# EAGLE design source_eagle (EAGLE 9.6.2)
COMPANY: ADAFRUIT INDUSTRIES; DRAWN: KTOWN; REV: A; YEAR: 2019
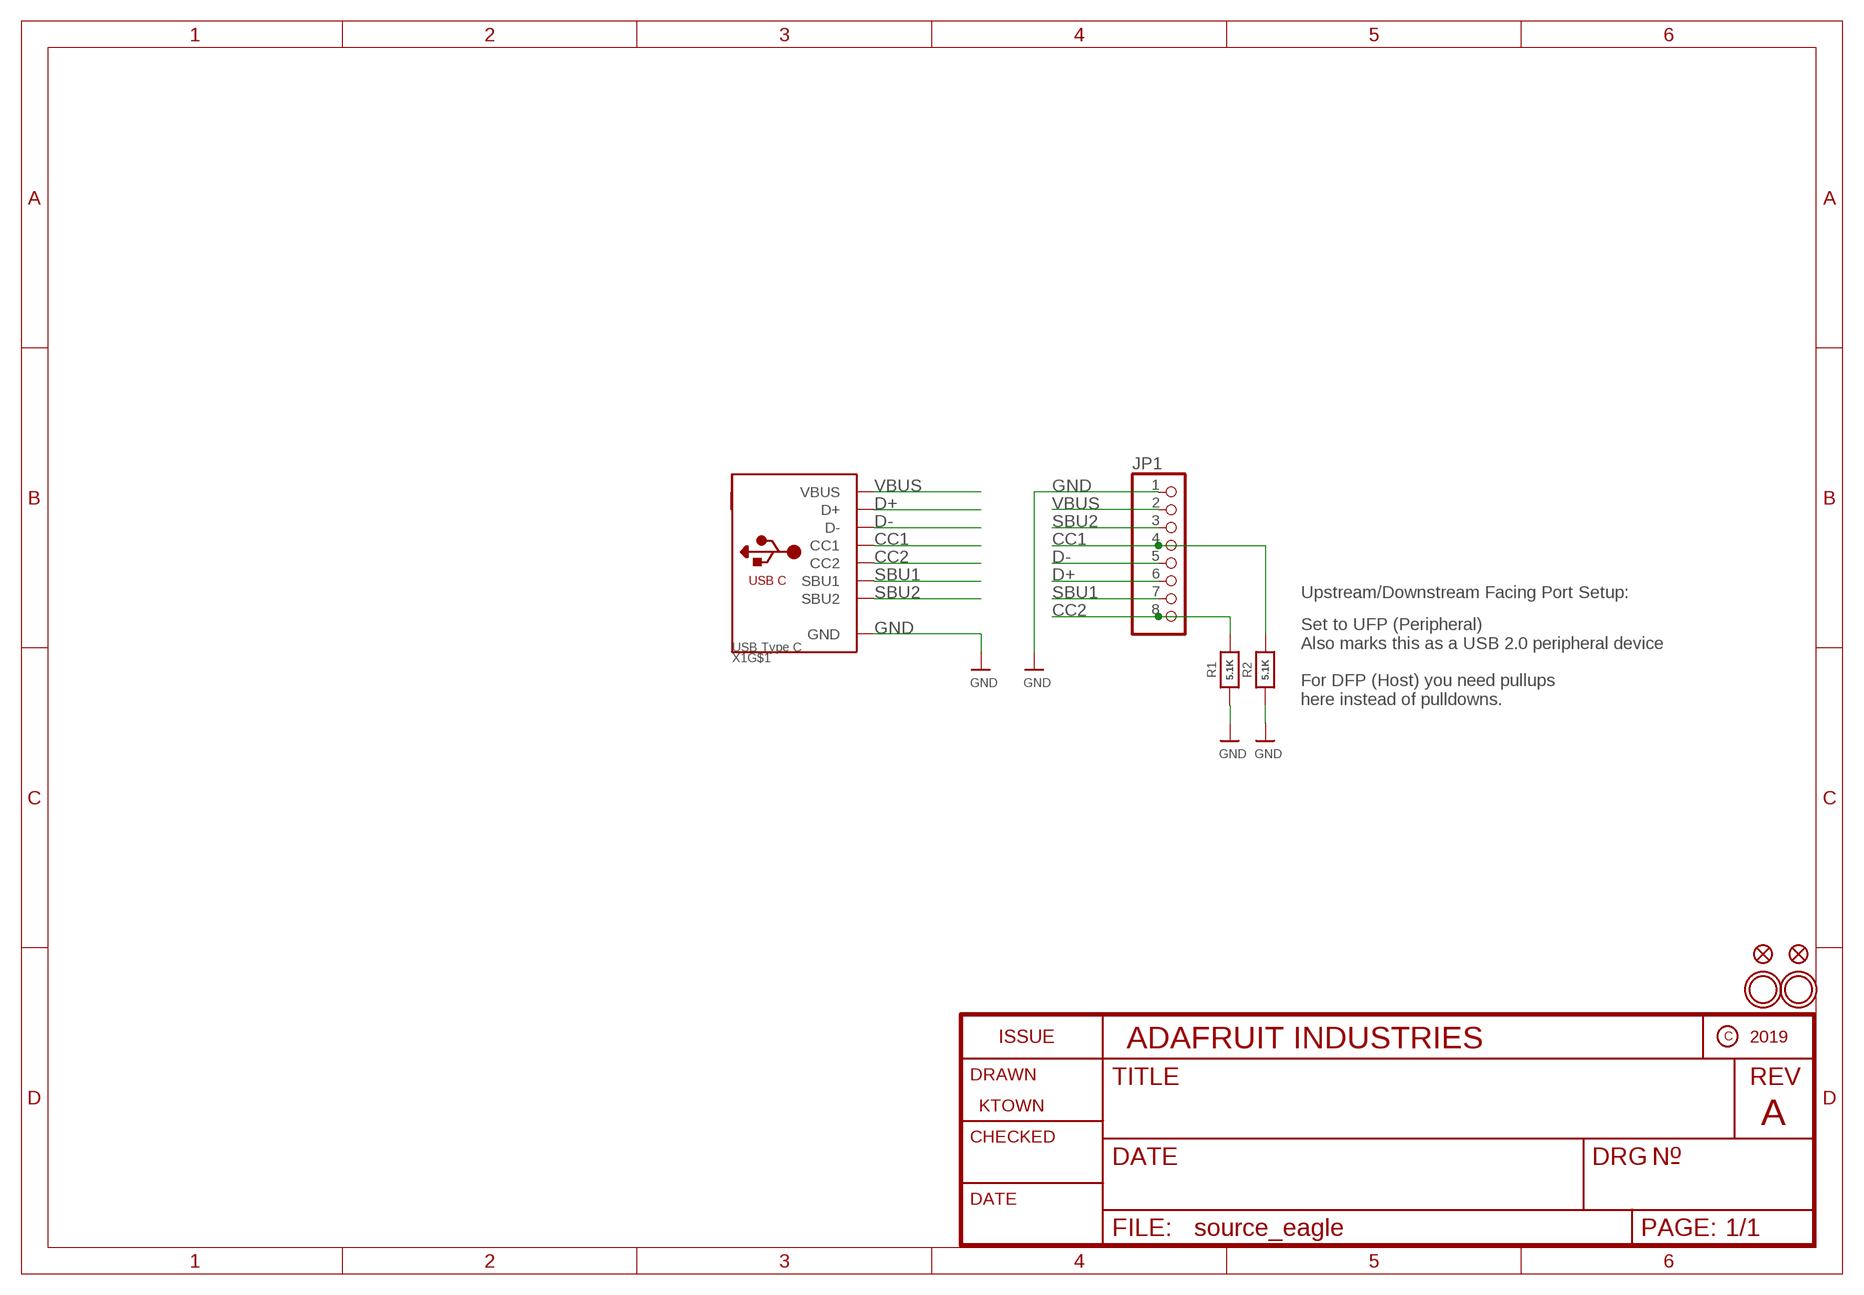
[diagram p0: schematic, sheet 1]

## Parts
FID1  FIDUCIAL_0.5MM  [FIDUCIAL_0.5MM]
FID2  FIDUCIAL_0.5MM  [FIDUCIAL_0.5MM]
JP1  HEADER-1X876MIL  [1X08_ROUND_76]
R1  5.1K  RESISTOR_0603_NOOUT  [0603-NO]
R2  5.1K  RESISTOR_0603_NOOUT  [0603-NO]
U$1  MOUNTINGHOLE2.5  [MOUNTINGHOLE_2.5_PLATED]
U$2  MOUNTINGHOLE2.5  [MOUNTINGHOLE_2.5_PLATED]
X1  USB Type C  USB_C_SINK  [USB_C_SINK]

## Nets
CC1: JP1.4 R2.2 X1.A5(CC1)
CC2: JP1.8 R1.2 X1.B5(CC2)
D+: JP1.6 X1.A6(D+) X1.B6(D+)
D-: JP1.5 X1.A7(D-) X1.B7(D-)
GND: JP1.1 R1.1 R2.1 X1.A1B12(GND) X1.B1A12(GND)
SBU1: JP1.7 X1.A8(SBU1)
SBU2: JP1.3 X1.B8(SBU2)
VBUS: JP1.2 X1.A4B9(VBUS) X1.B4A9(VBUS)
Unconnected: X1.M1(MT) X1.M2(MT) X1.M3(MT) X1.M4(MT)

## Notes on the sheet
- Upstream/Downstream Facing Port Setup:
- Set to UFP (Peripheral)
  Also marks this as a USB 2.0 peripheral device
  
  For DFP (Host) you need pullups
  here instead of pulldowns.

## Library data of the parts
FID1 FID2 = microbuilder:FIDUCIAL: Fiducial Alignment Points Various fiducial points for machine vision alignment.
JP1 = microbuilder:HEADER-1X8: PIN HEADER
R1 R2 = microbuilder:RESISTOR: Resistors For new designs, use the packages preceded by an '_' character since they are more reliable: The following footprints should be used on most boards: _0402 - Standard footprint for regular board layouts _0603 - Standard footprint for regular board layouts _0805 - Standard footprint for regular board layouts _1206 - Standard footprint for regular board layouts For extremely tight-pitch boards where space is at a premium, the following 'micro-pitch' footprints can be used (smaller pads, no silkscreen outline, etc.): _0402MP - Micro-pitch footprint for very dense/compact boards _0603MP - Micro-pitch footprint for very dense/compact boards _0805MP - Micro-pitch footprint for very dense/compact boards _1206MP - Micro-pitch footprint for very dense/compact boards
U$1 U$2 = adafruit_electromech:MOUNTINGHOLE: Mounting Hole For #2 screws (0.086"/2.18mm width, 0.094"/2.4mm hole) use 2.5mm; BOM: EXCLUDE
X1 = adafruit_electromech:USB_C: USB Type-C USB 2.0 Connector

## Board
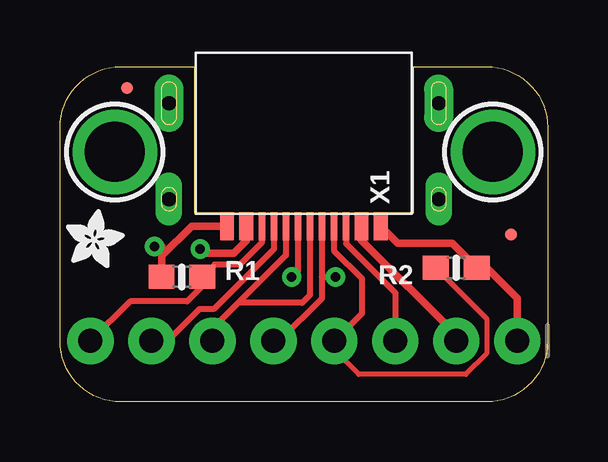
[diagram p1: board, top side]
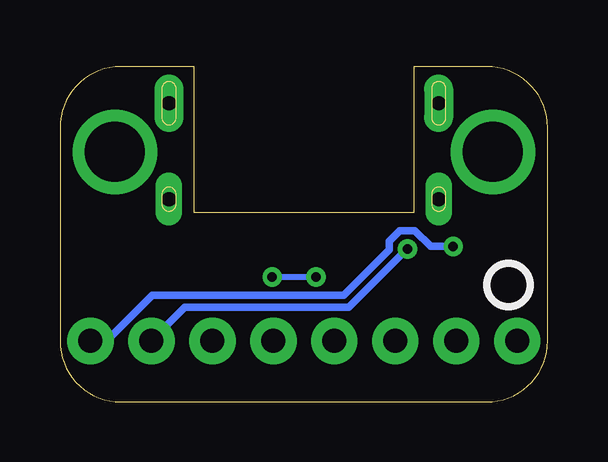
[diagram p2: board, bottom side, seen from below]

Size 20.32 x 13.97 mm. Coordinates in mm from the lower left corner, seen from the top.
Outline: 20.32,11.43 20.32,2.54 arc-90 17.78,0 2.54,0 arc-90 0,2.54 0,11.43 arc-90 2.54,13.97 5.59,13.97 5.59,7.87 14.73,7.87 14.73,13.97 17.78,13.97 arc-90 20.32,11.43
Copper layers (1*16): Top 0.035mm / dielectric 1.5mm / Bottom 0.035mm
Design rules "adafruit": minimum track width 8mil, minimum drill 15.5mil, track to track 8mil, track to pad 8mil, pad to pad 8mil, via to via 8mil, smd to smd 8mil, copper to edge 10mil, drill to drill 8mil, minimum pad ring 10mil, minimum via ring 8mil, stop-mask expansion 2mil, vias tented up to drill 20mil, thermal gap 10mil

### Footprints (pad centres in the part's own frame; a part is rotated, then mirrored left to right if it is on the bottom)
FIDUCIAL_0.5MM = smd 0.5 x 0.5: 1 0,0
1X08_ROUND_76 = drill 1 pad 1.93: 1 -8.89,0; 2 -6.35,0; 3 -3.81,0; 4 -1.27,0; 5 1.27,0; 6 3.81,0; 7 6.35,0; 8 8.89,0
0603-NO = smd 1.075 x 1: 1 -0.85,0; 2 0.85,0
MOUNTINGHOLE_2.5_PLATED = drill 2.5 pad 3.2: P$1 0,0
USB_C_SINK = smd 0.575 x 1.15: A1B12 -3.2,2.585; A4B9 -2.4,2.585; B1A12 3.2,2.585; B4A9 2.4,2.585 | smd 0.275 x 1.15: A5 -1.25,2.585; A6 -0.25,2.585; A7 0.25,2.585; A8 1.25,2.585; B5 1.75,2.585; B6 0.75,2.585; B7 -0.75,2.585; B8 -1.75,2.585 | drill 0.6 pad 1 long: M1 -5.62,1.46; M2 5.62,1.46 | drill 0.6 pad 1.2 long: M3 -5.62,-2.54; M4 5.62,-2.54

### Placement (x,y rotation side)
FID1  18.8,6.99 180 top
FID2  2.79,13.08 180 top
JP1  10.16,2.54 180 top
PLABEL0  [PLABEL0]  16.51,1.27 0 top
PLABEL1  [PLABEL1]  8.89,4.45 0 top
PLABEL2  [PLABEL2]  6.35,1.27 0 top
PLABEL3  [PLABEL3]  13.97,4.45 0 top
PLABEL4  [PLABEL4]  11.43,1.27 0 top
PLABEL5  [PLABEL5]  18.8,4.45 0 top
PLABEL6  [PLABEL6]  10.41,6.1 0 top
PLABEL7  [PLABEL7]  3.81,4.45 0 top
PLABEL8  [PLABEL8]  2.29,1.27 0 top
PLABEL9  [PLABEL9]  10.41,0.89 0 bottom
PLABEL10  [PLABEL10]  9.91,5.21 0 bottom
R1  5.08,5.21 0 top
R2  16.51,5.59 180 top
U$1  18.03,10.41 180 top
U$2  2.29,10.41 180 top
U$3  [ADAFRUIT_2.5MM]  0.25,5.59 0 top
U$8  [PCBFEAT-REV-040]  1.63,4.88 180 bottom
X1  10.16,9.91 180 top

### Tracks (layer width: path | path; a pad name or v marks a point on that pad's centre or on a via)
CC1
  Top 0.203: R2.2 17.78,3.47 17.78,2.01 16.91,1.14 12.45,1.14 11.43,2.16 JP1.4
  Top 0.254: X1.A5 11.41,6.3 12.57,5.14 12.57,3.68 JP1.4
CC2
  Top 0.254: X1.B5 8.41,6.63 7.49,5.71 6.44,5.71 R1.2 5.93,4.83 5.29,4.19 2.92,4.19 JP1.8
D+
  Top 0.254: X1.B6 9.41,6.11 7.43,4.13 | 7.43,4.13 6.35,3.05 JP1.6 | X1.A6 10.41,4.45 10.09,4.13 7.43,4.13
D-  (via drill 0.39)
  Top 0.254: X1.B7 10.91,5.21 | 10.91,5.21 10.91,4.31 9.14,2.54 JP1.5 | X1.A7 9.91,5.46 v9.65,5.2 | v11.48,5.2 10.92,5.2 10.91,5.21
  Bottom 0.254: v9.65,5.2 v11.48,5.2
GND  (via drill 0.39)
  Top 0.305: JP1.1 19.05,4.32 17.78,5.59 R2.1 16.34,6.6 14.08,6.6 X1.A1B12 | X1.B1A12 5.49,7.32 4.23,6.08 | R1.1 4.23,6.08 | 4.23,6.08 4.23,6.48 v3.94,6.48
  Bottom 0.305: v3.94,6.48 4.88,6.48 5.53,7.13 6.16,7.13 6.6,6.69 6.6,6.34 8.49,4.45 16.47,4.45 18.38,2.54 JP1.1
SBU1
  Top 0.254: X1.A8 8.91,6.37 6.4,3.86 5.8,3.86 4.48,2.54
  Top 0.305: 4.48,2.54 JP1.7
SBU2
  Top 0.254: X1.B8 11.92,6.6 13.97,4.55 JP1.3
VBUS  (via drill 0.39)
  Top 0.305: X1.A4B9 12.56,6.74 16.51,2.79 JP1.2 | X1.B4A9 7.76,6.72 7.24,6.2 6.02,6.2 v5.84,6.38
  Bottom 0.305: v5.84,6.38 8.28,3.94 15.11,3.94 JP1.2

### Text on the board
Pinguin_tBackup: USB C | SBU1 | D- | SBU2 | GND | CC2 | D+ | CC1 | VBUS
Pinguin_bBackup: downstream / USB C Breakout | adafruit!